# Altium schematic sheet LPCB235 - MECHANICAL.SchDoc
size A3; Address1: Factory 10; Address2: 9-13 Dingley Avenue, Dandeong, VICTORIA 3175, AUSTRALIA; DocumentNumber: 16; Revision: 1; SheetNumber: 16; SheetTotal: 37; Lockie__PCB_SUB_ASSEMBLY: Mechanical Parts; Lockie__PCB_ASSEMBLY: FCU PCB; Lockie__LDL: LPCB235; Lockie__PCB_DESCRIPTION: Flight Control Unit
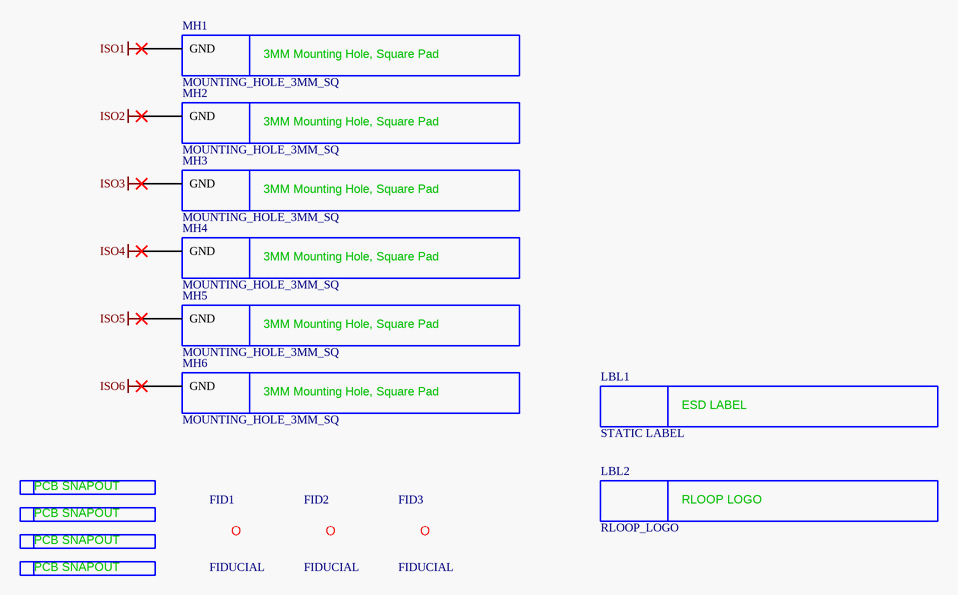
[diagram p0: LPCB235 - MECHANICAL.SchDoc]

## Parts
FID1  FIDUCIAL  [LFP113__FIDUCIAL]  (no BOM)
FID2  FIDUCIAL  [LFP113__FIDUCIAL]  (no BOM)
FID3  FIDUCIAL  [LFP113__FIDUCIAL]  (no BOM)
LBL1  STATIC LABEL  [STATIC_LABEL]  (no BOM)
LBL2  RLOOP_LOGO  [RLOOP_LOGO]  (no BOM)
MH1  MOUNTING_HOLE_3MM_SQ  [MOUNTING_HOLE_3MM_SQ]  (no BOM)
MH2  MOUNTING_HOLE_3MM_SQ  [MOUNTING_HOLE_3MM_SQ]  (no BOM)
MH3  MOUNTING_HOLE_3MM_SQ  [MOUNTING_HOLE_3MM_SQ]  (no BOM)
MH4  MOUNTING_HOLE_3MM_SQ  [MOUNTING_HOLE_3MM_SQ]  (no BOM)
MH5  MOUNTING_HOLE_3MM_SQ  [MOUNTING_HOLE_3MM_SQ]  (no BOM)
MH6  MOUNTING_HOLE_3MM_SQ  [MOUNTING_HOLE_3MM_SQ]  (no BOM)
SN1  PCB_SNAPOUT  [SNAPOUT_NEW]  (value not drawn)  (no BOM)
SN2  PCB_SNAPOUT  [SNAPOUT_NEW]  (value not drawn)  (no BOM)
SN3  PCB_SNAPOUT  [SNAPOUT_NEW]  (value not drawn)  (no BOM)
SN4  PCB_SNAPOUT  [SNAPOUT_NEW]  (value not drawn)  (no BOM)

## Nets
ISO1: MH1.MOUNT(GND)
ISO2: MH2.MOUNT(GND)
ISO3: MH3.MOUNT(GND)
ISO4: MH4.MOUNT(GND)
ISO5: MH5.MOUNT(GND)
ISO6: MH6.MOUNT(GND)

## Notes on the sheet
- PCB COMPONENT DESCRIPTION
- LDL NUMBER
- Assembly Details
- Size
- Drawing File Name
- Revision
- http://rloop.org
- Scale
- A3
- Sheet Details
- N.T.S
- Sheet:
- Of:
- (in symbol MOUNTING_HOLE_3MM_SQ) 3MM Mounting Hole, Square Pad
- (in symbol PCB_SNAPOUT) PCB SNAPOUT
- (in symbol RLOOP_LOGO) RLOOP LOGO
- (in symbol STATIC LABEL) ESD LABEL

## Library data of the parts
FID1-FID3 = FIDUCIAL: SMD Device Fiducial; FMEDA__CHANNEL: COM
LBL1 = STATIC LABEL: FMEDA__CHANNEL: DIAG; FMEDA__FUNCTION_IN_SYSTEM: *
LBL2 = RLOOP_LOGO: FMEDA__CHANNEL: DIAG; FMEDA__FUNCTION_IN_SYSTEM: *
MH1-MH6 = MOUNTING_HOLE_3MM_SQ: 3MM Mouting Hole, Square; FMEDA__CHANNEL: DIAG; FMEDA__FUNCTION_IN_SYSTEM: *